# EAGLE design gps-neo-n8 (EAGLE 7.2.0)
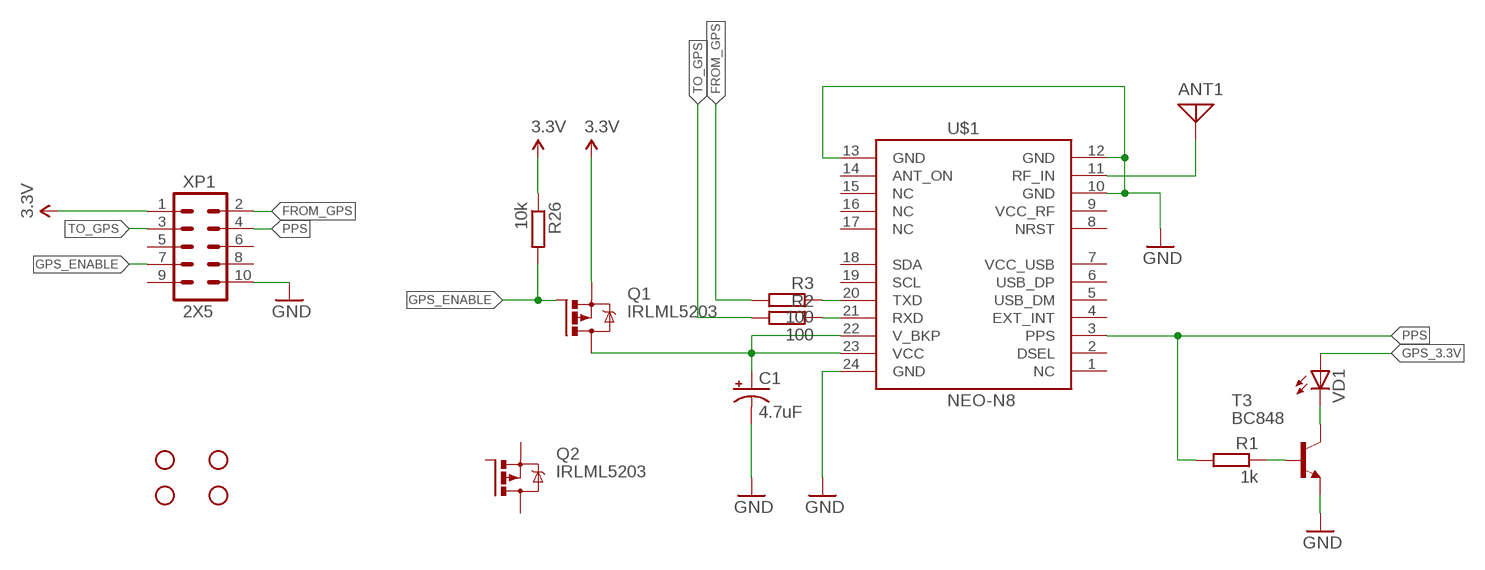
[diagram p0: schematic, sheet 1]

## Parts
ANT1  GPS_ANTENNA'35X35'  [GPS_ANT_35X35MM]
C1  4.7uF  CAP_POL1206-KIT  [EIA3216-KIT]
JP1  STAND-OFF  [STAND-OFF]
JP2  STAND-OFF  [STAND-OFF]
JP4  STAND-OFF  [STAND-OFF]
JP5  STAND-OFF  [STAND-OFF]
Q1  IRLML5203  [MICRO3]
Q2  IRLML5203  [MICRO3]
R1  1k  R-EU_R0805  [R0805]
R2  100  R-EU_R0805  [R0805]
R3  100  R-EU_R0805  [R0805]
R26  10k  R-EU_R0805  [R0805]
T3  BC848  [SOT23]
U$1  NEO-N8  [NEO-M8]
VD1  LED0805  [LED-0805]
XP1  2X5  [2X5-PSEUDOSMD]

## Nets
3.3V: Q1.2(S) R26.1 XP1.1
FROM_GPS: R3.2 XP1.2
GND: C1.C(-) T3.2(E) U$1.10(GND) U$1.12(GND) U$1.13(GND) U$1.24(GND) XP1.10
GPS_3.3V: C1.A(+) Q1.3(D) U$1.22(V_BKP) U$1.23(VCC) VD1.A
GPS_ENABLE: Q1.1(G) R26.2 XP1.7
N$1: T3.3(C) VD1.C
N$2: ANT1.1 U$1.11(RF_IN)
N$3: R1.1 T3.1(B)
N$4: R2.1 U$1.21(RXD)
N$8: R3.1 U$1.20(TXD)
PPS: R1.2 U$1.3(PPS) XP1.4
TO_GPS: R2.2 XP1.3
Unconnected: Q2.1(G) Q2.2(S) Q2.3(D) U$1.1(NC) U$1.2(DSEL) U$1.4(EXT_INT) U$1.5(USB_DM) U$1.6(USB_DP) U$1.7(VCC_USB) U$1.8(NRST) U$1.14(ANT_ON) U$1.15(NC) U$1.16(NC) U$1.17(NC) U$1.18(SDA) U$1.19(SCL) XP1.5 XP1.6 XP1.8 XP1.9

## Power pins joined to a net without a drawn wire
VCC_RF: U$1.9(VCC_RF)

## Library data of the parts
ANT1 = barthess:GPS_ANTENNA: GPS passive antenna
C1 = SparkFun:CAP_POL: Capacitor Polarized These are standard SMD and PTH capacitors. Normally 10uF, 47uF, and 100uF in electrolytic and tantalum varieties. Always verify the external diameter of the through hole cap, it varies with capacity, voltage, and manufacturer. The EIA devices should be standard.
JP1 JP2 JP4 JP5 = barthess:STAND-OFF: Stand Off This is the mechanical footprint for a #4 phillips button head screw. Use the keepout ring to avoid running the screw head into surrounding components. SKU : PRT-00447
Q1 Q2 = transistor-power:IRLML5203: HEXFET P-Channel Power MOSFET
R1-R3 R26 = rcl:R-EU_: RESISTOR, European symbol
T3 = transistor:BC848: NPN TRANSISTOR
U$1 = barthess:NEO-N8
VD1 = barthess:LED: LEDs Standard schematic elements and footprints for 5mm, 3mm, 1206, and 0603 sized LEDs. 5mm - Spark Fun Electronics SKU : COM-00529 (and others)
XP1 = barthess:2X5

## Board
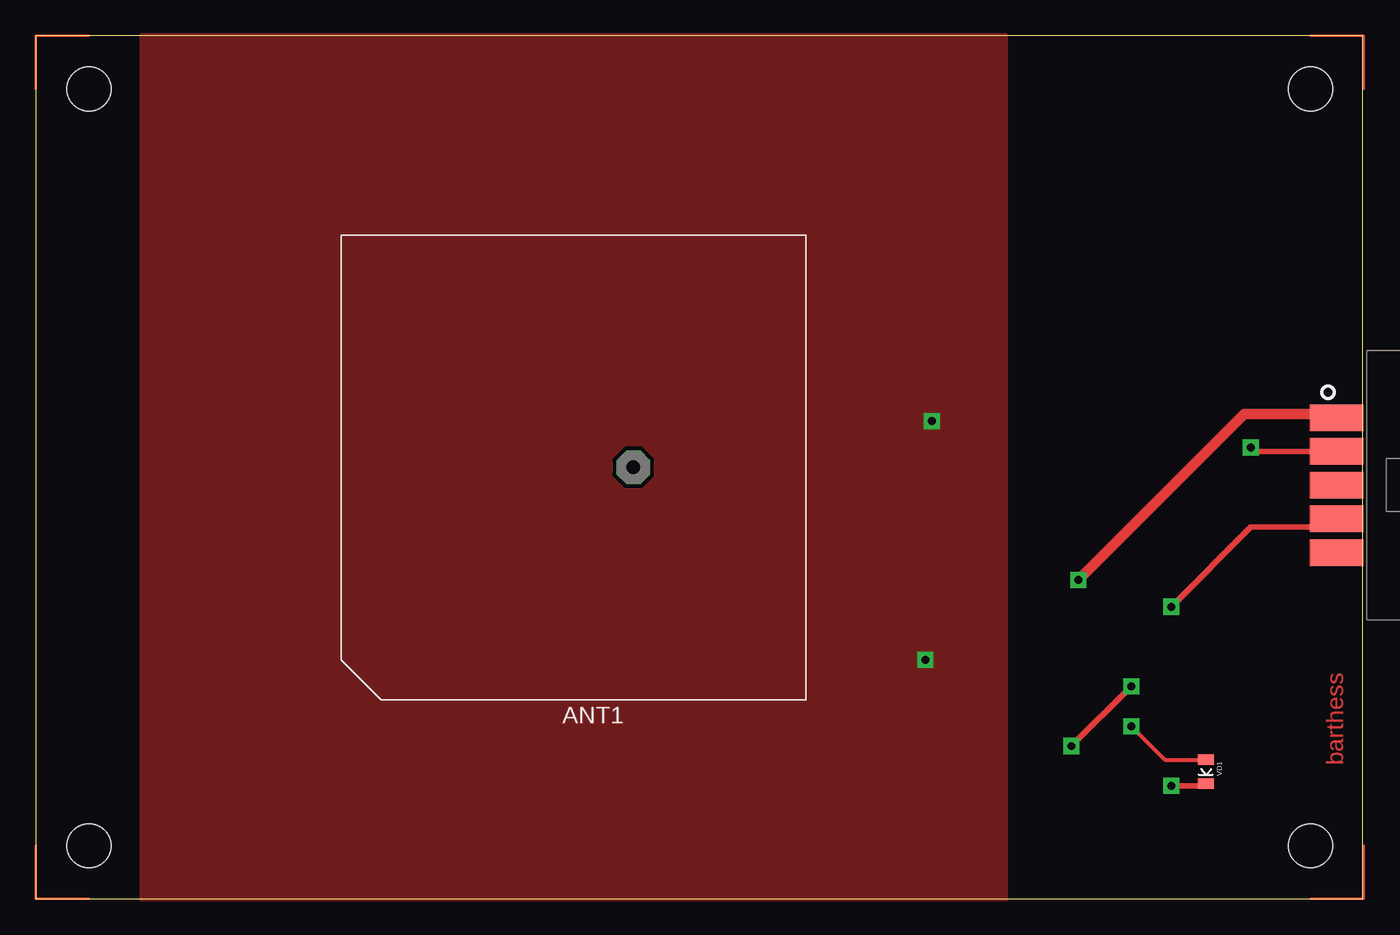
[diagram p1: board, top side]
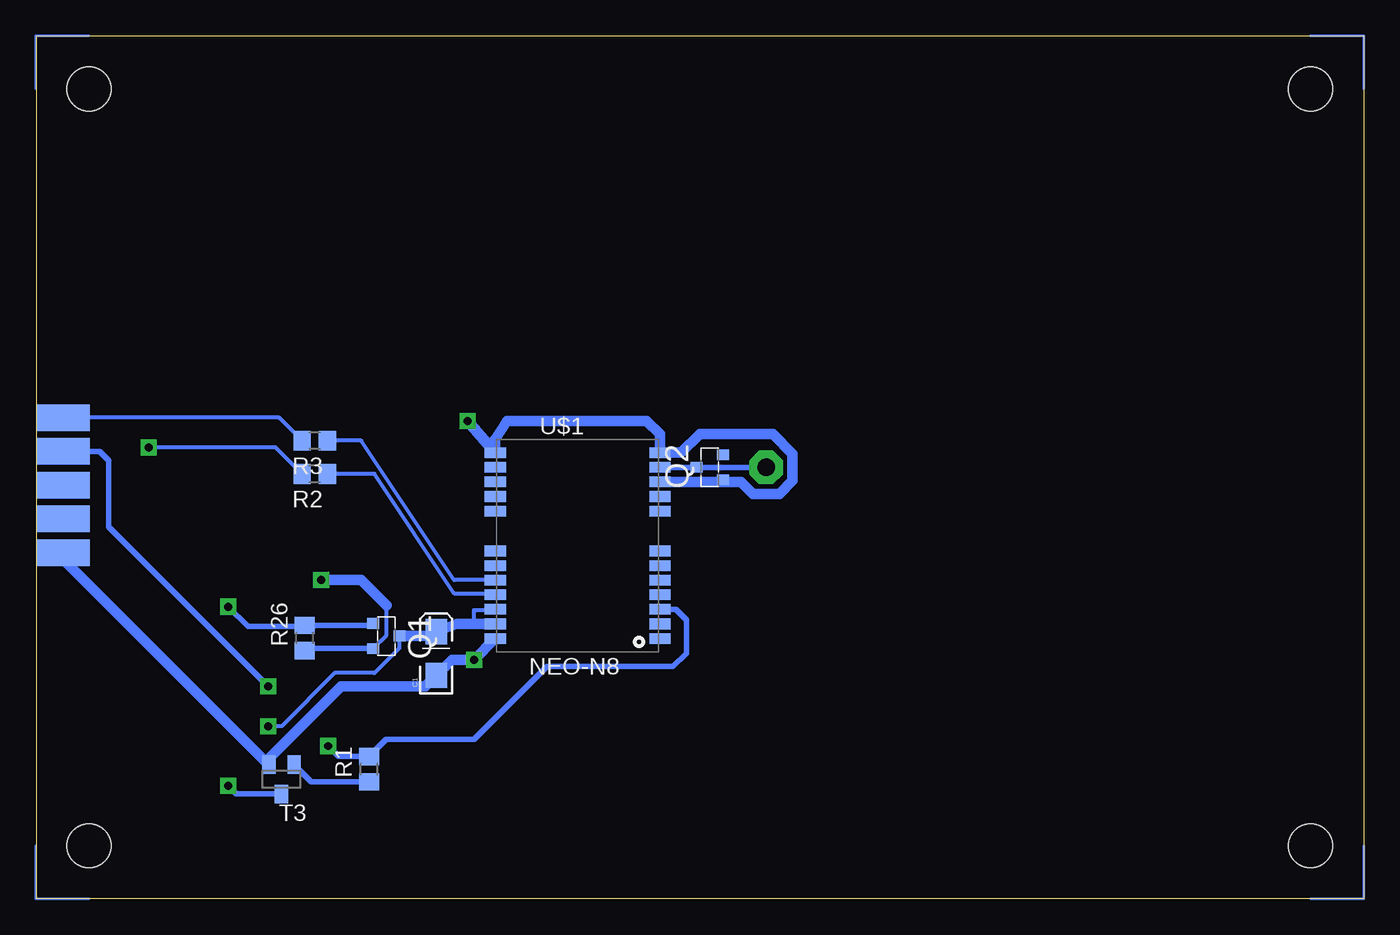
[diagram p2: board, bottom side, seen from below]

Size 99.94 x 64.99 mm. Coordinates in mm from the lower left corner, seen from the top.
Outline: 0,0 99.94,0 99.94,64.99 0,64.99 0,0
Copper layers (1*16): Top 0.035mm / dielectric 1.5mm / Bottom 0.035mm
Design rules "default *": minimum track width 1mm, minimum drill 32mil, track to track 12mil, track to pad 12mil, pad to pad 12mil, via to via 12mil, smd to smd 8mil, copper to edge 0mil, drill to drill 40mil, minimum pad ring 12mil, minimum via ring 12mil, stop-mask expansion 4mil, vias tented up to drill 0mil, thermal gap 10mil

### Footprints (pad centres in the part's own frame; a part is rotated, then mirrored left to right if it is on the bottom)
GPS_ANT_35X35MM = drill 1.321 pad 2.54 octagon: 1 13,-17.5
EIA3216-KIT = smd 1.9 x 1.6: A 1.65,0; C -1.65,0
STAND-OFF = hole 3.3: 0,0
MICRO3 = smd 0.8 x 0.9: 1 -0.95,-1; 2 0.95,-1; 3 0,1
R0805 = smd 1.3 x 1.5: 1 -0.95,0; 2 0.95,0
SOT23 = smd 1 x 1.4: 1 -0.95,-1.1; 2 0.95,-1.1; 3 0,1.1
NEO-M8 = smd 1.6 x 0.8: 1 12.3,-15; 2 12.3,-13.9; 3 12.3,-12.8; 4 12.3,-11.7; 5 12.3,-10.6; 6 12.3,-9.5; 7 12.3,-8.4; 8 12.3,-5.4; 9 12.3,-4.3; 10 12.3,-3.2; 11 12.3,-2.1; 12 12.3,-1; 13 -0.1,-1; 14 -0.1,-2.1; 15 -0.1,-3.2; 16 -0.1,-4.3; 17 -0.1,-5.4; 18 -0.1,-8.4; 19 -0.1,-9.5; 20 -0.1,-10.6; 21 -0.1,-11.7; 22 -0.1,-12.8; 23 -0.1,-13.9; 24 -0.1,-15
LED-0805 = smd 0.8 x 1.2: A -0.9,0; C 0.9,0
2X5-PSEUDOSMD = smd 4 x 2: 1 0,5.08; 3 0,2.54; 5 0,0; 7 0,-2.54; 9 0,-5.08 | smd 4 x 2 bottom: 2 0,5.08; 4 0,2.54; 6 0,0; 8 0,-2.54; 10 0,-5.08

### Placement (x,y rotation side)
ANT1  58,15 180 top
C1  69.84,18.48 90 bottom
JP1  4,4 0 top
JP2  4,61 0 top
JP4  96,61 0 top
JP5  96,4 0 top
Q1  73.61,19.8 270 bottom
Q2  49.25,32.5 90 bottom
R1  74.91,9.76 90 bottom
R2  79,32 180 bottom
R3  79,34.5 180 bottom
R26  79.75,19.64 90 bottom
T3  81.5,9 180 bottom
U$1  65.3,34.6 0 bottom
U$2  [LOGO_CHIBIOS_SIGNAL]  91.5,51.25 0 top
VD1  88.11,9.58 270 top
XP1  97.96,31.16 0 top

### Tracks (layer width: path | path; a pad name or v marks a point on that pad's centre or on a via)
3.3V  (via drill 0.6)
  Top 0.305: 97.7,36.5 XP1.1
  Top 0.8: v78.5,24 91,36.5 97.7,36.5
  Bottom 0.305: 73.6,22.1 73.6,19.85 Q1.2
  Bottom 0.406: Q1.2 79.59,18.84 R26.1
  Bottom 0.8: 73.6,22.1 75.5,24 v78.5,24
FROM_GPS
  Bottom 0.305: R3.2 81.69,36.24 XP1.2
GND  (via drill 0.6)
  Bottom 0.8: U$1.10 46.9,31.4 46,30.5 44,30.5 43,31.5 43,33.5 44.5,35 50,35 51.4,33.6 U$1.12 53,35 54,36 64.5,36 65.4,34.6 U$1.13 65.5,33.7 v67.5,36 | XP1.10 97.96,25.61 T3.2 82.45,10.55 77,16 70.67,16 C1.C 68.67,18 v67,18 U$1.24
  pour Top: 8,0 8,65 73,65 73,0
GPS_3.3V  (via drill 0.6)
  Top 0.305: v82.5,13 85.02,10.48 VD1.A
  Bottom 0.305: v82.5,13 81.5,13 77.5,17 74.5,17 72.61,18.89 Q1.3 | U$1.23 67,20.7 67,21.75 65.4,21.75 U$1.22
  Bottom 0.8: U$1.23 68.27,20.7 C1.A 70.17,19.8 Q1.3
GPS_ENABLE  (via drill 0.6)
  Top 0.406: v85.5,22 91.5,28 97.34,28 XP1.7
  Bottom 0.305: Q1.1 74.75,20.59
  Bottom 0.406: v85.5,22 84,20.5 79.09,20.5 79,20.59 | 74.75,20.59 79,20.59 | 79,20.59 R26.2
N$1  (via drill 0.6)
  Top 0.406: v85.5,8.5 87.94,8.5 VD1.C
  Bottom 0.406: T3.3 84.9,7.9 v85.5,8.5
N$2
  Bottom 0.406: U$1.11 ANT1.1
N$3
  Bottom 0.406: R1.1 79.26,8.81 T3.1
N$4
  Bottom 0.305: U$1.21 65.5,23 68.5,23 74.5,32 R2.1
N$5
  Bottom 0.2: 0,4 0,0 4,0
N$6
  Bottom 0.2: 0,61 0,65 4,65
N$7
  Bottom 0.2: 96,65 100,65 100,61
N$8
  Bottom 0.305: U$1.20 68.5,24 75.5,34.5 R3.1
N$9
  Bottom 0.2: 96,0 100,0 100,4
N$10
  Top 0.2: 4,0 0,0 0,4
N$11
  Top 0.2: 0,61 0,65 4,65
N$12
  Top 0.2: 96,65 100,65 100,61
N$13
  Top 0.2: 96,0 100,0 100,4
PPS  (via drill 0.6)
  Top 0.406: v78,11.5 v82.5,16
  Bottom 0.406: U$1.3 51.8,21.8 51,21 51,18.5 52,17.5 61.5,17.5 67,12 73.61,12 R1.2 77.21,10.71 v78,11.5 | v82.5,16 94.5,28 94.5,33 95.2,33.7 XP1.4
TO_GPS  (via drill 0.6)
  Top 0.406: v91.5,34 91.8,33.7 XP1.3
  Bottom 0.305: R2.2 81.95,34 v91.5,34

### Text on the board
Top: barthess